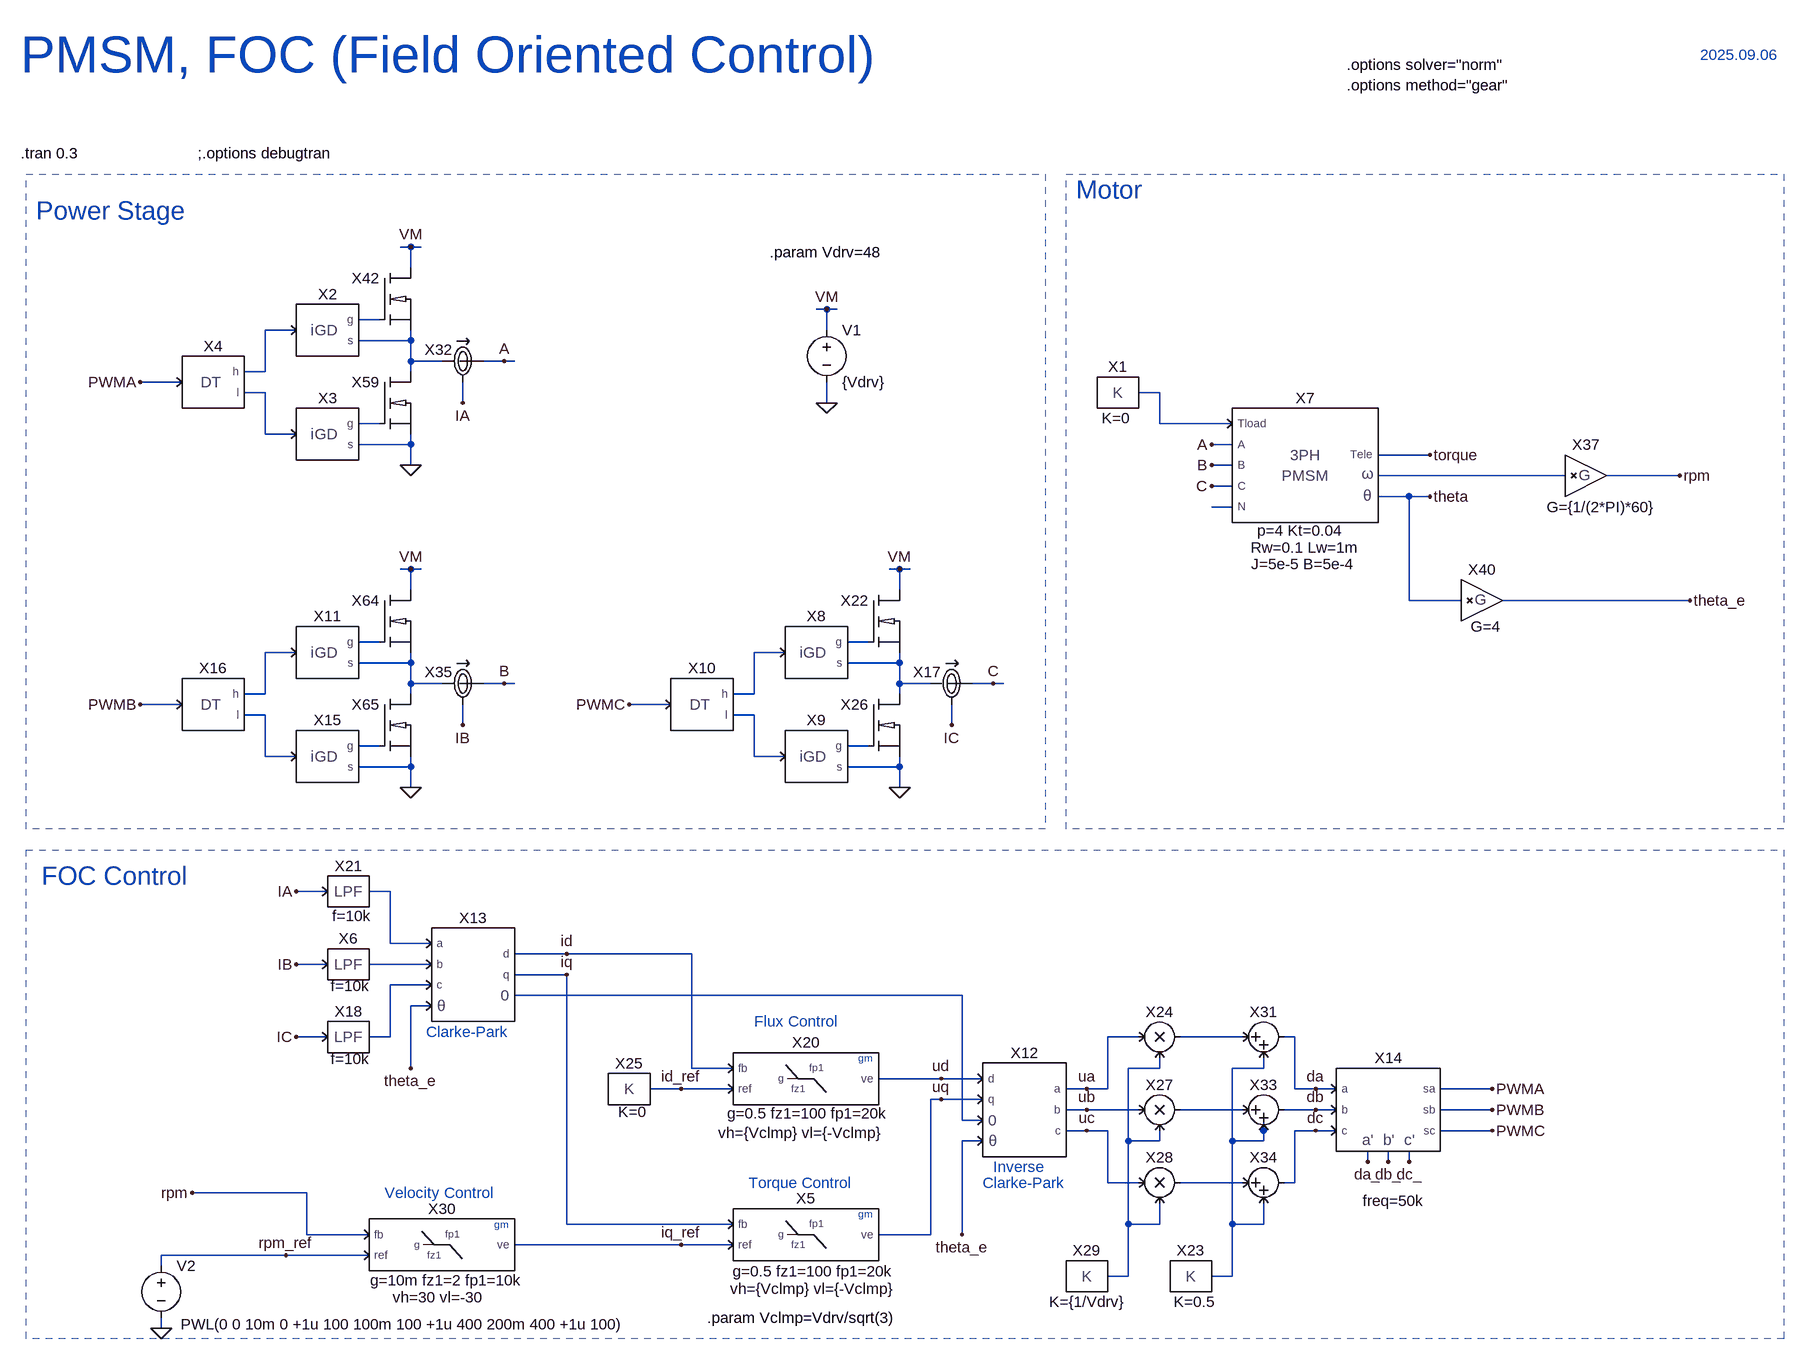
[diagram p0: schematic PMSM_FOC.asc]
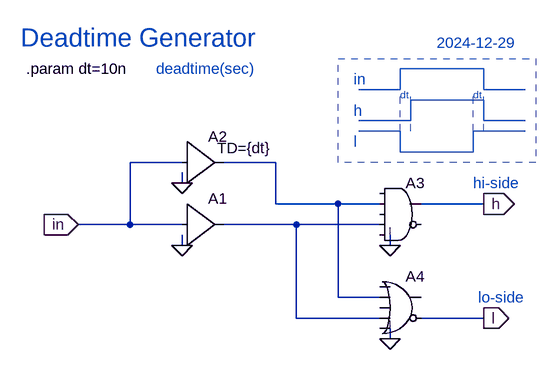
[diagram p1: sub-circuit deadtime.asc]
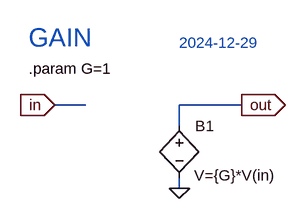
[diagram p2: sub-circuit gain.asc]
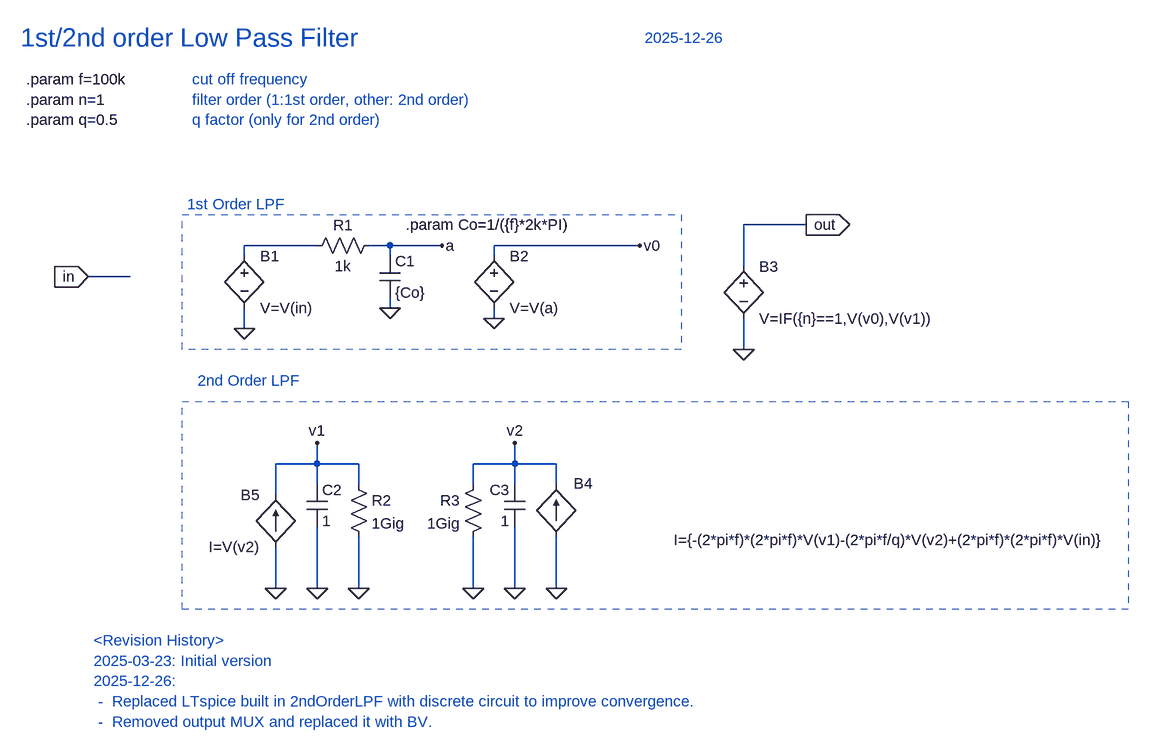
[diagram p3: sub-circuit lpf.asc]
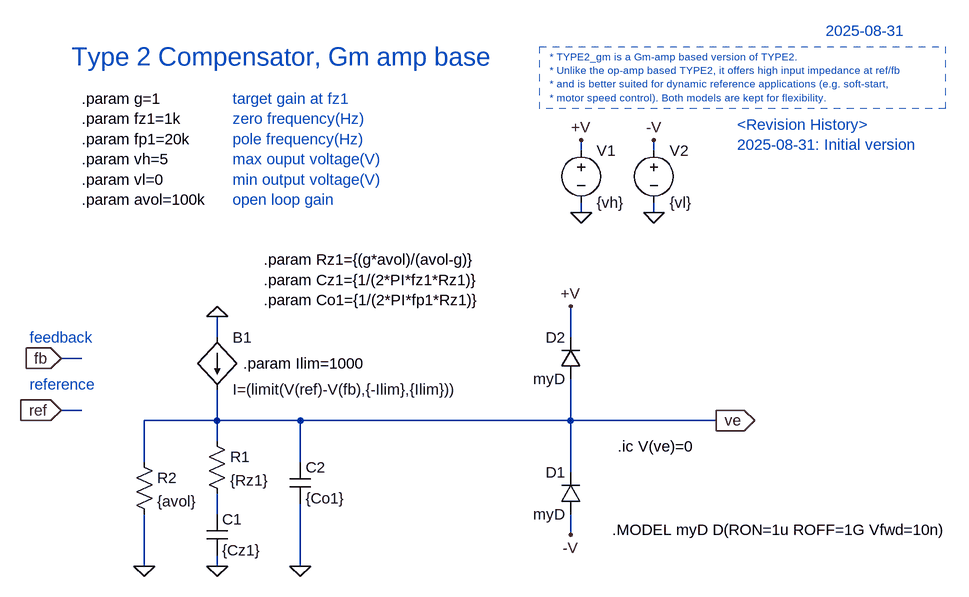
[diagram p4: sub-circuit type2_gm.asc]
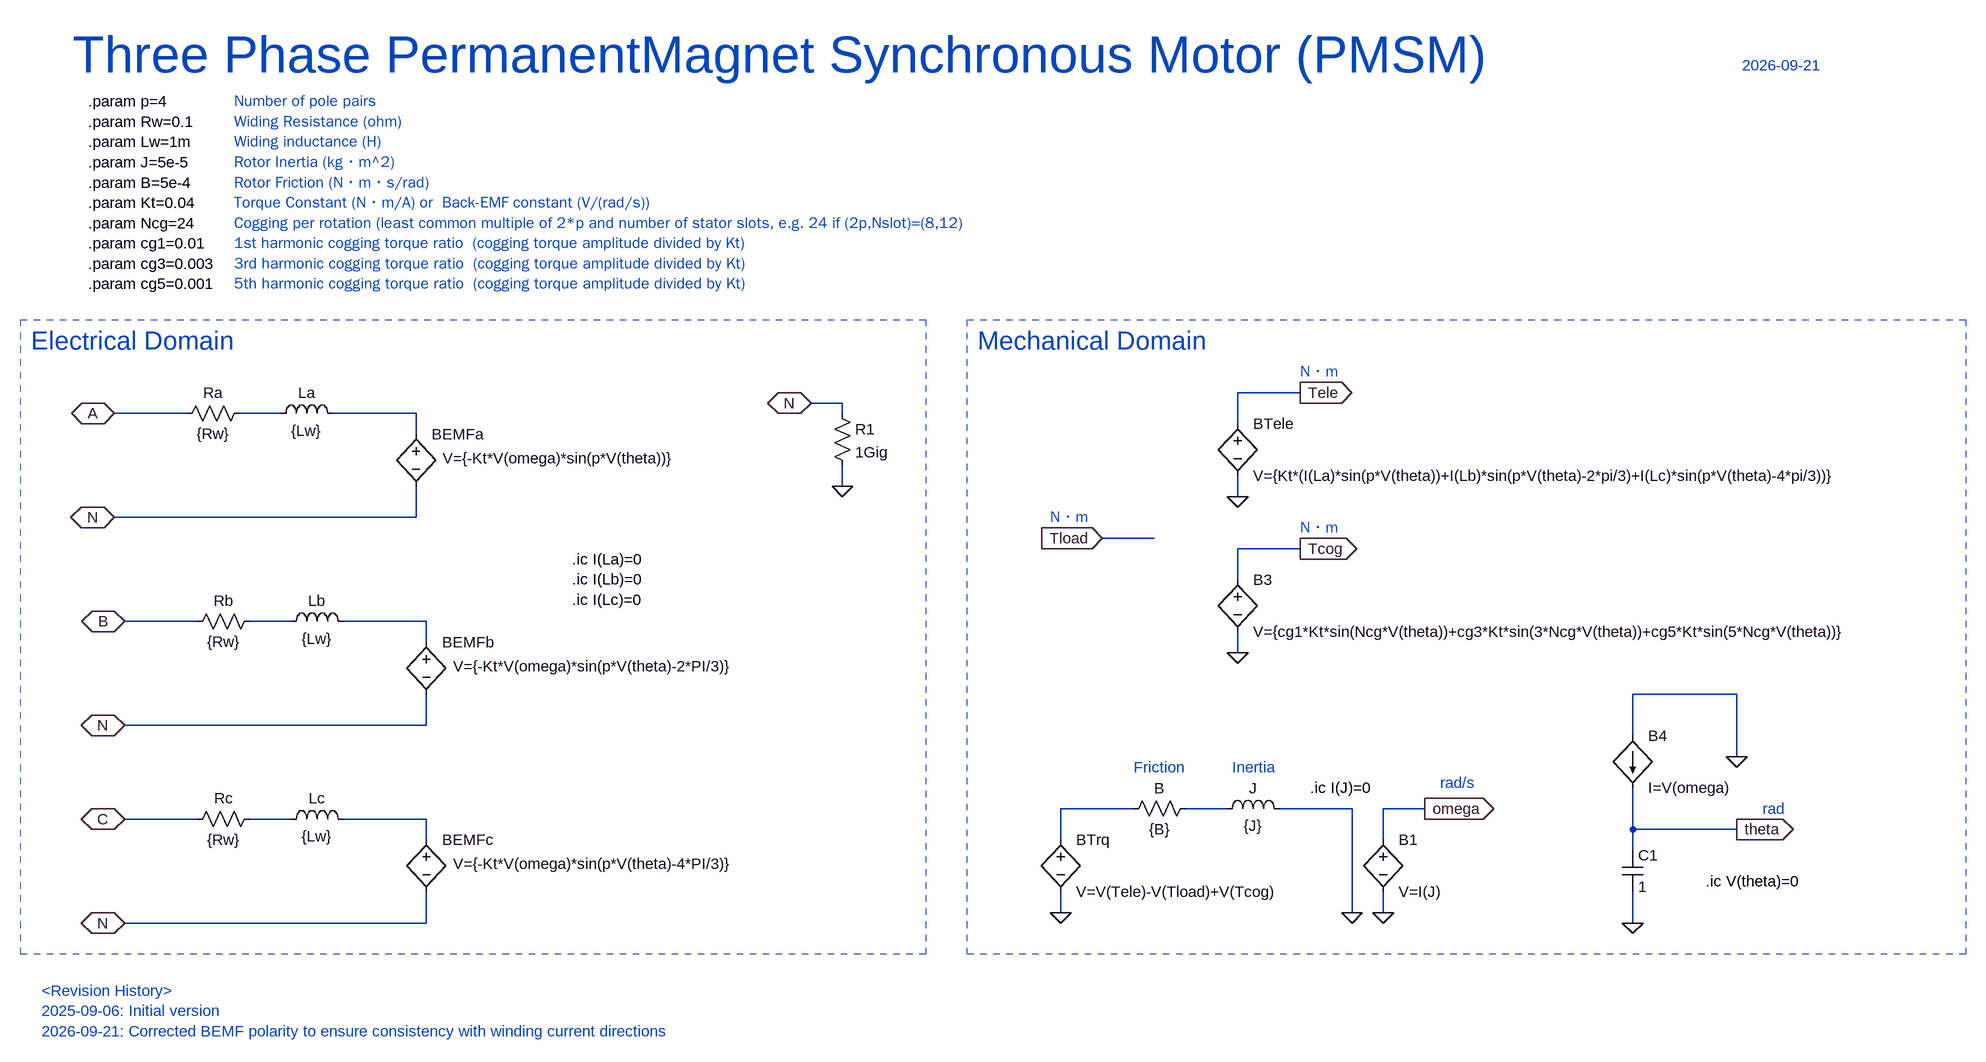
[diagram p5: sub-circuit pmsm.asc]
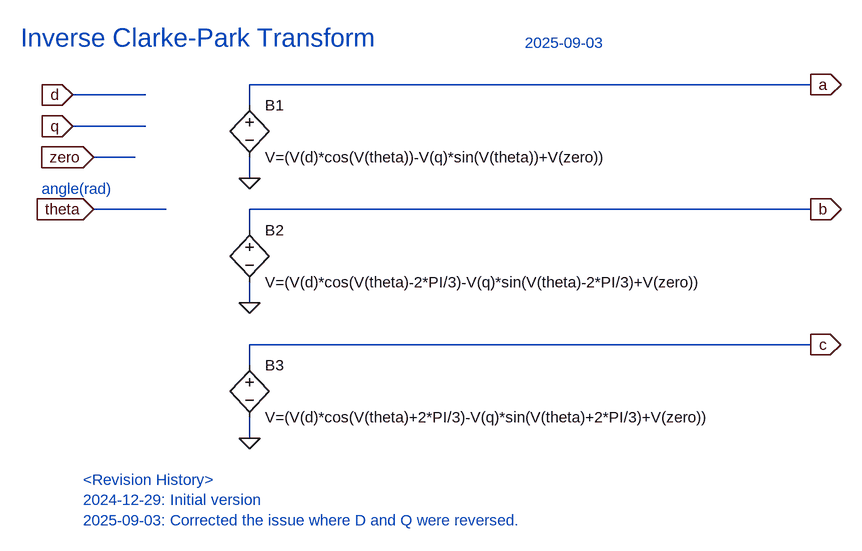
[diagram p6: sub-circuit clarke_parkinv.asc]
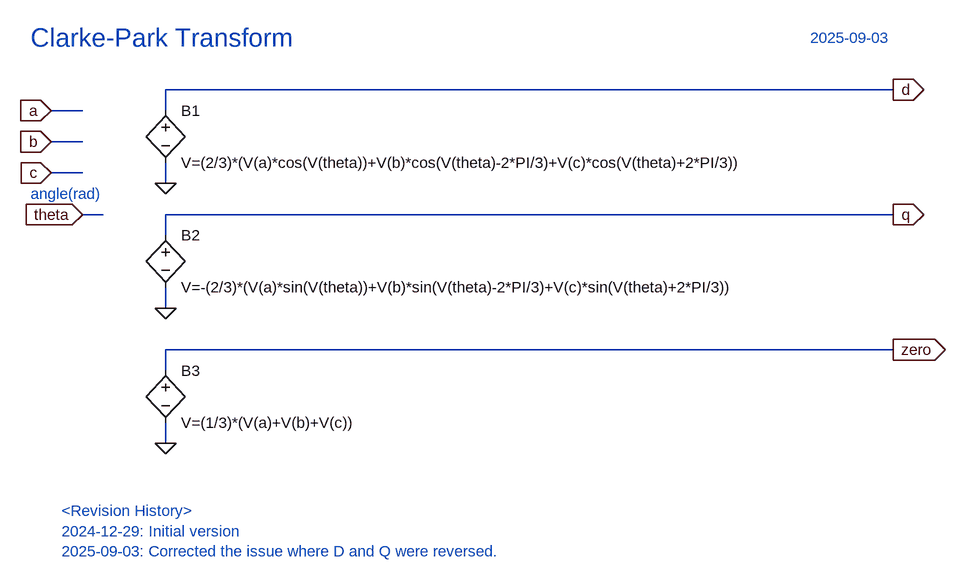
[diagram p7: sub-circuit clarke_park.asc]
PMSM_FOC.asc, the LTspice schematic file:
Version 4.1
SHEET 1 5496 2604
WIRE 3088 -96 3072 -96
WIRE 3104 -96 3088 -96
WIRE 3088 -64 3088 -96
WIRE 3728 0 3712 0
WIRE 3744 0 3728 0
WIRE 3040 16 3008 16
WIRE 2912 32 2864 32
WIRE 3728 32 3728 0
WIRE 3088 48 3088 32
WIRE 3088 48 3008 48
WIRE 3088 80 3088 48
WIRE 3136 80 3088 80
WIRE 3232 80 3200 80
WIRE 3248 80 3232 80
WIRE 2864 96 2864 32
WIRE 2864 96 2832 96
WIRE 3088 96 3088 80
WIRE 2736 112 2672 112
WIRE 2864 128 2832 128
WIRE 4240 128 4208 128
WIRE 3168 144 3168 112
WIRE 3728 144 3728 112
WIRE 3040 176 3008 176
WIRE 4240 176 4240 128
WIRE 4352 176 4240 176
WIRE 2864 192 2864 128
WIRE 2912 192 2864 192
WIRE 3088 208 3088 192
WIRE 3088 208 3008 208
WIRE 4352 208 4320 208
WIRE 4656 224 4576 224
WIRE 3088 240 3088 208
WIRE 4352 240 4320 240
WIRE 4864 256 4576 256
WIRE 5040 256 4928 256
WIRE 4352 272 4320 272
WIRE 4624 288 4576 288
WIRE 4656 288 4624 288
WIRE 4352 304 4320 304
WIRE 3088 400 3072 400
WIRE 3104 400 3088 400
WIRE 3840 400 3824 400
WIRE 3856 400 3840 400
WIRE 3088 432 3088 400
WIRE 3840 432 3840 400
WIRE 4624 448 4624 288
WIRE 4704 448 4624 448
WIRE 5056 448 4768 448
WIRE 3040 512 3008 512
WIRE 3792 512 3760 512
WIRE 2912 528 2864 528
WIRE 3664 528 3616 528
WIRE 3088 544 3088 528
WIRE 3088 544 3008 544
WIRE 3840 544 3840 528
WIRE 3840 544 3760 544
WIRE 3088 576 3088 544
WIRE 3136 576 3088 576
WIRE 3232 576 3200 576
WIRE 3248 576 3232 576
WIRE 3840 576 3840 544
WIRE 3888 576 3840 576
WIRE 3984 576 3952 576
WIRE 4000 576 3984 576
WIRE 2864 592 2864 528
WIRE 2864 592 2832 592
WIRE 3088 592 3088 576
WIRE 3616 592 3616 528
WIRE 3616 592 3584 592
WIRE 3840 592 3840 576
WIRE 2736 608 2672 608
WIRE 3488 608 3424 608
WIRE 2864 624 2832 624
WIRE 3616 624 3584 624
WIRE 3168 640 3168 608
WIRE 3920 640 3920 608
WIRE 3040 672 3008 672
WIRE 3792 672 3760 672
WIRE 2864 688 2864 624
WIRE 2912 688 2864 688
WIRE 3616 688 3616 624
WIRE 3664 688 3616 688
WIRE 3088 704 3088 688
WIRE 3088 704 3008 704
WIRE 3840 704 3840 688
WIRE 3840 704 3760 704
WIRE 3088 736 3088 704
WIRE 3840 736 3840 704
WIRE 2960 896 2912 896
WIRE 3056 896 3024 896
WIRE 3056 976 3056 896
WIRE 3120 976 3056 976
WIRE 3328 992 3248 992
WIRE 3520 992 3328 992
WIRE 2960 1008 2912 1008
WIRE 3120 1008 3024 1008
WIRE 3328 1024 3248 1024
WIRE 3120 1040 3056 1040
WIRE 3936 1056 3248 1056
WIRE 3120 1072 3088 1072
WIRE 2960 1120 2912 1120
WIRE 3056 1120 3056 1040
WIRE 3056 1120 3024 1120
WIRE 4208 1120 4160 1120
WIRE 4368 1120 4272 1120
WIRE 4448 1120 4432 1120
WIRE 3088 1168 3088 1072
WIRE 3520 1168 3520 992
WIRE 3584 1168 3520 1168
WIRE 4240 1168 4240 1152
WIRE 4240 1168 4192 1168
WIRE 4400 1168 4400 1152
WIRE 4400 1168 4352 1168
WIRE 3904 1184 3808 1184
WIRE 3968 1184 3904 1184
WIRE 3504 1200 3456 1200
WIRE 3584 1200 3504 1200
WIRE 4128 1200 4096 1200
WIRE 4160 1200 4160 1120
WIRE 4160 1200 4128 1200
WIRE 4448 1200 4448 1120
WIRE 4480 1200 4448 1200
WIRE 4512 1200 4480 1200
WIRE 4752 1200 4672 1200
WIRE 3904 1216 3888 1216
WIRE 3968 1216 3904 1216
WIRE 4128 1232 4096 1232
WIRE 4208 1232 4128 1232
WIRE 4368 1232 4272 1232
WIRE 4480 1232 4432 1232
WIRE 4512 1232 4480 1232
WIRE 4752 1232 4672 1232
WIRE 3936 1248 3936 1056
WIRE 3968 1248 3936 1248
WIRE 4128 1264 4096 1264
WIRE 4160 1264 4128 1264
WIRE 4400 1264 4400 1248
WIRE 4480 1264 4448 1264
WIRE 4512 1264 4480 1264
WIRE 4752 1264 4672 1264
WIRE 3968 1280 3936 1280
WIRE 4192 1280 4192 1168
WIRE 4240 1280 4240 1264
WIRE 4240 1280 4192 1280
WIRE 4352 1280 4352 1168
WIRE 4400 1280 4400 1264
WIRE 4400 1280 4352 1280
WIRE 4560 1312 4560 1296
WIRE 4592 1312 4592 1296
WIRE 4624 1312 4624 1296
WIRE 4160 1344 4160 1264
WIRE 4208 1344 4160 1344
WIRE 4368 1344 4272 1344
WIRE 4448 1344 4448 1264
WIRE 4448 1344 4432 1344
WIRE 2928 1360 2752 1360
WIRE 3328 1408 3328 1024
WIRE 3584 1408 3328 1408
WIRE 4192 1408 4192 1280
WIRE 4240 1408 4240 1376
WIRE 4240 1408 4192 1408
WIRE 4352 1408 4352 1280
WIRE 4400 1408 4400 1376
WIRE 4400 1408 4352 1408
WIRE 2928 1424 2928 1360
WIRE 3024 1424 2928 1424
WIRE 3888 1424 3888 1216
WIRE 3888 1424 3808 1424
WIRE 3936 1424 3936 1280
WIRE 3504 1440 3248 1440
WIRE 3584 1440 3504 1440
WIRE 2896 1456 2704 1456
WIRE 3024 1456 2896 1456
WIRE 2704 1472 2704 1456
WIRE 4192 1488 4192 1408
WIRE 4192 1488 4160 1488
WIRE 4352 1488 4352 1408
WIRE 4352 1488 4320 1488
WIRE 2704 1568 2704 1552
FLAG 3504 1200 id_ref
FLAG 3328 992 id
FLAG 3328 1024 iq
FLAG 3088 1168 theta_e
FLAG 3936 1424 theta_e
FLAG 4656 288 theta
FLAG 3088 240 0
FLAG 3232 80 A
FLAG 4320 240 B
FLAG 3088 -96 VM
FLAG 2672 112 PWMA
FLAG 4656 224 torque
FLAG 3088 736 0
FLAG 3232 576 B
FLAG 3088 400 VM
FLAG 2672 608 PWMB
FLAG 3728 144 0
FLAG 3728 0 VM
FLAG 3168 144 IA
FLAG 3168 640 IB
FLAG 4320 208 A
FLAG 4320 272 C
FLAG 5040 256 rpm
FLAG 2912 896 IA
FLAG 2912 1008 IB
FLAG 3904 1184 ud
FLAG 3904 1216 uq
FLAG 2896 1456 rpm_ref
FLAG 2752 1360 rpm
FLAG 3504 1440 iq_ref
FLAG 3840 736 0
FLAG 3984 576 C
FLAG 3840 400 VM
FLAG 3424 608 PWMC
FLAG 3920 640 IC
FLAG 4752 1200 PWMA
FLAG 4752 1232 PWMB
FLAG 4752 1264 PWMC
FLAG 2912 1120 IC
FLAG 4128 1200 ua
FLAG 4128 1232 ub
FLAG 4128 1264 uc
FLAG 4480 1200 da
FLAG 4480 1232 db
FLAG 4480 1264 dc
FLAG 5056 448 theta_e
FLAG 4560 1312 da_
FLAG 4592 1312 db_
FLAG 4624 1312 dc_
FLAG 2704 1568 0
SYMBOL CONST 4176 128 R0
WINDOW 39 -3 55 Bottom 2
SYMATTR SpiceLine K=0
SYMATTR InstName X1
SYMBOL iGD 2960 32 R0
SYMATTR InstName X2
SYMBOL iGD 2960 192 R0
SYMATTR InstName X3
SYMBOL DEADTIME 2784 112 R0
SYMATTR InstName X4
SYMBOL iGD 2960 528 R0
SYMATTR InstName X11
SYMBOL iGD 2960 688 R0
SYMATTR InstName X15
SYMBOL DEADTIME 2784 608 R0
SYMATTR InstName X16
SYMBOL voltage 3728 16 R0
SYMATTR InstName V1
SYMATTR Value {Vdrv}
SYMBOL IMON 3168 80 R0
SYMATTR InstName X32
SYMBOL IMON 3168 576 R0
SYMATTR InstName X35
SYMBOL GAIN 4896 256 R0
WINDOW 39 23 64 Bottom 2
SYMATTR SpiceLine G={1/(2*PI)*60}
SYMATTR InstName X37
SYMBOL iNMOS 3088 -16 R0
SYMATTR InstName X42
SYMBOL iNMOS 3088 144 R0
SYMATTR InstName X59
SYMBOL iNMOS 3088 480 R0
SYMATTR InstName X64
SYMBOL iNMOS 3088 640 R0
SYMATTR InstName X65
SYMBOL LPF 2992 896 R0
WINDOW 3 5 53 Bottom 2
SYMATTR Value f=10k
SYMATTR InstName X21
SYMBOL TYPE2_gm 3136 1440 R0
WINDOW 39 7 70 Bottom 2
WINDOW 40 -6 96 Bottom 2
SYMATTR SpiceLine g=10m fz1=2 fp1=10k
SYMATTR SpiceLine2 vh=30 vl=-30
SYMATTR InstName X30
SYMBOL TYPE2_gm 3696 1184 R0
WINDOW 39 3 69 Bottom 2
WINDOW 40 -9 99 Bottom 2
SYMATTR SpiceLine g=0.5 fz1=100 fp1=20k
SYMATTR SpiceLine2 vh={Vclmp} vl={-Vclmp}
SYMATTR InstName X20
SYMBOL TYPE2_gm 3696 1424 R0
WINDOW 39 12 72 Bottom 2
WINDOW 40 10 99 Bottom 2
SYMATTR SpiceLine g=0.5 fz1=100 fp1=20k
SYMATTR SpiceLine2 vh={Vclmp} vl={-Vclmp}
SYMATTR InstName X5
SYMBOL LPF 2992 1008 R0
WINDOW 3 3 49 Bottom 2
SYMATTR Value f=10k
SYMATTR InstName X6
SYMBOL PMSM 4464 240 R0
WINDOW 3 -8 116 Bottom 2
WINDOW 123 0 142 Bottom 2
WINDOW 39 -3 168 Bottom 2
SYMATTR InstName X7
SYMBOL iGD 3712 528 R0
SYMATTR InstName X8
SYMBOL iGD 3712 688 R0
SYMATTR InstName X9
SYMBOL DEADTIME 3536 608 R0
SYMATTR InstName X10
SYMBOL IMON 3920 576 R0
SYMATTR InstName X17
SYMBOL iNMOS 3840 480 R0
SYMATTR InstName X22
SYMBOL iNMOS 3840 640 R0
SYMATTR InstName X26
SYMBOL CLARKE_PARKinv 4032 1232 R0
SYMATTR InstName X12
SYMBOL CLARKE_PARK 3184 1024 R0
SYMATTR InstName X13
SYMBOL SV_PWM 4592 1232 R0
WINDOW 39 8 156 Bottom 2
SYMATTR SpiceLine freq=50k
SYMATTR InstName X14
SYMBOL LPF 2992 1120 R0
WINDOW 3 3 49 Bottom 2
SYMATTR Value f=10k
SYMATTR InstName X18
SYMBOL MUL 4240 1120 R0
SYMATTR InstName X24
SYMBOL MUL 4240 1232 R0
SYMATTR InstName X27
SYMBOL MUL 4240 1344 R0
SYMATTR InstName X28
SYMBOL CONST 4128 1488 R0
WINDOW 39 0 55 Bottom 2
SYMATTR SpiceLine K={1/Vdrv}
SYMATTR InstName X29
SYMBOL SUM 4400 1120 R0
SYMATTR InstName X31
SYMBOL SUM 4400 1232 R0
SYMATTR InstName X33
SYMBOL SUM 4400 1344 R0
SYMATTR InstName X34
SYMBOL CONST 4288 1488 R0
WINDOW 39 6 55 Bottom 2
SYMATTR SpiceLine K=0.5
SYMATTR InstName X23
SYMBOL GAIN 4736 448 R0
WINDOW 39 6 56 Bottom 2
SYMATTR SpiceLine G=4
SYMATTR InstName X40
SYMBOL CONST 3424 1200 R0
WINDOW 39 5 51 Bottom 2
SYMATTR SpiceLine K=0
SYMATTR InstName X25
SYMBOL voltage 2704 1456 R0
WINDOW 123 0 0 Left 0
WINDOW 39 0 0 Left 0
WINDOW 3 30 106 Left 2
SYMATTR Value PWL(0 0 10m 0 +1u 100 100m 100 +1u 400 200m 400 +1u 100)
SYMATTR InstName V2
TEXT 2488 -240 Left 2 !.tran 0.3
TEXT 4528 -376 Left 2 !.options solver="norm"\n.options method="gear"
TEXT 2488 -392 Left 6 ;PMSM, FOC (Field Oriented Control)
TEXT 4112 -184 Left 4 ;Motor
TEXT 5072 -392 Left 2 ;2025.09.06
TEXT 2512 -152 Left 4 ;Power Stage
TEXT 3608 1344 Left 2 ;Torque Control
TEXT 3616 1096 Left 2 ;Flux Control
TEXT 2760 -240 Left 2 !;.options debugtran
TEXT 3048 1360 Left 2 ;Velocity Control
TEXT 3640 -88 Left 2 !.param Vdrv=48
TEXT 2520 872 Left 4 ;FOC Control
TEXT 3776 1152 Left 1 ;gm
TEXT 3776 1392 Left 1 ;gm
TEXT 3216 1408 Left 1 ;gm
TEXT 3112 1112 Left 2 ;Clarke-Park
TEXT 3968 1344 Left 2 ;Clarke-Park
TEXT 3984 1320 Left 2 ;Inverse
TEXT 3544 1552 Left 2 !.param Vclmp=Vdrv/sqrt(3)
RECTANGLE Normal 4064 800 2496 -208 2
RECTANGLE Normal 5200 800 4096 -208 2
RECTANGLE Normal 5200 1584 2496 832 2

deadtime.asc, the sub-circuit schematic file:
Version 4
SHEET 1 1412 1312
WIRE 64 288 -16 288
WIRE 208 288 128 288
WIRE 64 320 64 304
WIRE 208 352 208 288
WIRE 304 352 208 352
WIRE 368 352 304 352
WIRE 528 352 432 352
WIRE -16 384 -16 288
WIRE -16 384 -96 384
WIRE 64 384 -16 384
WIRE 240 384 128 384
WIRE 368 384 240 384
WIRE 64 416 64 400
WIRE 384 416 384 400
WIRE 304 496 304 352
WIRE 368 496 304 496
WIRE 240 528 240 384
WIRE 368 528 240 528
WIRE 528 528 432 528
WIRE 384 560 384 544
FLAG -96 384 in
IOPIN -96 384 In
FLAG 64 416 0
FLAG 64 320 0
FLAG 384 416 0
FLAG 384 560 0
FLAG 528 352 h
IOPIN 528 352 Out
FLAG 528 528 l
IOPIN 528 528 Out
SYMBOL Digital\\buf1 64 320 R0
SYMATTR InstName A1
SYMBOL Digital\\buf1 64 224 R0
WINDOW 3 54 42 Left 2
SYMATTR Value TD={dt}
SYMATTR InstName A2
SYMBOL Digital\\and 400 304 R0
SYMATTR InstName A3
SYMBOL Digital\\or 400 448 R0
SYMATTR InstName A4
TEXT -176 144 Left 2 !.param dt=10n
TEXT -184 96 Left 4 ;Deadtime Generator
TEXT 24 144 Left 2 ;deadtime(sec)
TEXT 512 320 Left 2 ;hi-side
TEXT 520 496 Left 2 ;lo-side
TEXT 328 160 Left 2 ;in
TEXT 328 208 Left 2 ;h
TEXT 328 256 Left 2 ;l
TEXT 400 184 Left 1 ;dt
TEXT 512 184 Left 1 ;dt
TEXT 456 104 Left 2 ;2024-12-29
LINE Normal 400 176 336 176
LINE Normal 400 176 400 144
LINE Normal 528 144 400 144
LINE Normal 528 176 528 144
LINE Normal 592 176 528 176
LINE Normal 416 224 336 224
LINE Normal 416 224 416 192
LINE Normal 528 192 416 192
LINE Normal 528 224 528 192
LINE Normal 592 224 528 224
LINE Normal 400 240 336 240
LINE Normal 400 272 400 240
LINE Normal 512 272 400 272
LINE Normal 512 272 512 240
LINE Normal 592 240 512 240
LINE Normal 400 240 400 176 2
LINE Normal 512 240 512 176 2
LINE Normal 416 240 416 176 2
LINE Normal 528 240 528 176 2
RECTANGLE Normal 608 288 304 128 2

gain.asc, the sub-circuit schematic file:
Version 4
SHEET 1 880 680
WIRE 0 64 -48 64
WIRE 240 64 144 64
WIRE 144 96 144 64
WIRE 144 192 144 176
FLAG 144 192 0
FLAG 240 64 out
IOPIN 240 64 Out
FLAG -48 64 in
IOPIN -48 64 In
SYMBOL bv 144 80 R0
WINDOW 3 23 92 Left 2
SYMATTR Value V={G}*V(in)
SYMATTR InstName B1
TEXT -88 8 Left 2 !.param G=1
TEXT -88 -40 Left 4 ;GAIN
TEXT 144 -32 Left 2 ;2024-12-29

lpf.asc, the sub-circuit schematic file:
Version 4.1
SHEET 1 1652 804
WIRE 944 -80 848 -80
WIRE 192 -48 80 -48
WIRE 304 -48 272 -48
WIRE 384 -48 304 -48
WIRE 688 -48 464 -48
WIRE 80 -32 80 -48
WIRE 304 -32 304 -48
WIRE 464 -32 464 -48
WIRE 848 -16 848 -80
WIRE -96 0 -160 0
WIRE 304 48 304 32
WIRE 464 64 464 48
WIRE 80 80 80 48
WIRE 848 112 848 64
WIRE 192 288 192 256
WIRE 192 288 128 288
WIRE 256 288 192 288
WIRE 496 288 496 256
WIRE 496 288 432 288
WIRE 560 288 496 288
WIRE 192 320 192 288
WIRE 256 320 256 288
WIRE 432 320 432 288
WIRE 496 320 496 288
WIRE 560 320 560 288
WIRE 128 336 128 288
WIRE 128 480 128 416
WIRE 192 480 192 384
WIRE 256 480 256 400
WIRE 432 480 432 400
WIRE 496 480 496 384
WIRE 560 480 560 400
FLAG -160 0 in
IOPIN -160 0 In
FLAG 944 -80 out
IOPIN 944 -80 Out
FLAG 304 48 0
FLAG 80 80 0
FLAG 384 -48 a
FLAG 464 64 0
FLAG 848 112 0
FLAG 256 480 0
FLAG 192 256 v1
FLAG 496 256 v2
FLAG 128 480 0
FLAG 560 480 0
FLAG 688 -48 v0
FLAG 192 480 0
FLAG 496 480 0
FLAG 432 480 0
SYMBOL res 288 -64 R90
WINDOW 0 0 56 VBottom 2
WINDOW 3 32 56 VTop 2
SYMATTR InstName R1
SYMATTR Value 1k
SYMBOL cap 288 -32 R0
SYMATTR InstName C1
SYMATTR Value {Co}
SYMBOL bv 80 -48 R0
SYMATTR InstName B1
SYMATTR Value V=V(in)
SYMBOL bv 464 -48 R0
SYMATTR InstName B2
SYMATTR Value V=V(a)
SYMBOL bv 848 -32 R0
SYMATTR InstName B3
SYMATTR Value V=IF({n}==1,V(v0),V(v1))
SYMBOL res 240 304 R0
SYMATTR InstName R2
SYMATTR Value 1Gig
SYMBOL cap 176 320 R0
SYMATTR InstName C2
SYMATTR Value 1
SYMBOL bi 128 416 R180
WINDOW 0 24 80 Left 2
WINDOW 3 24 0 Left 2
SYMATTR InstName B5
SYMATTR Value I=V(v2)
SYMBOL res 448 304 M0
SYMATTR InstName R3
SYMATTR Value 1Gig
SYMBOL cap 512 320 M0
SYMATTR InstName C3
SYMATTR Value 1
SYMBOL bi 560 400 R180
WINDOW 3 -848 -5 Left 2
WINDOW 0 -56 82 Left 2
SYMATTR Value I={-(2*pi*f)*(2*pi*f)*V(v1)-(2*pi*f/q)*V(v2)+(2*pi*f)*(2*pi*f)*V(in)}
SYMATTR InstName B4
TEXT -264 -368 Left 4 ;1st/2nd order Low Pass Filter
TEXT 696 -368 Left 2 ;2025-12-26
TEXT -256 -304 Left 2 !.param f=100k\n.param n=1\n.param q=0.5
TEXT 328 -80 Left 2 !.param Co=1/({f}*2k*PI)
TEXT 0 -304 Left 2 ;cut off frequency\nfilter order (1:1st order, other: 2nd order)\nq factor (only for 2nd order)
TEXT -8 -112 Left 2 ;1st Order LPF
TEXT 8 160 Left 2 ;2nd Order LPF
TEXT -152 560 Left 2 ;<Revision History>\n2025-03-23: Initial version\n2025-12-26: \n -  Replaced LTspice built in 2ndOrderLPF with discrete circuit to improve convergence.\n -  Removed output MUX and replaced it with BV.
RECTANGLE Normal 752 112 -16 -96 2
RECTANGLE Normal 1440 512 -16 192 2

type2_gm.asc, the sub-circuit schematic file:
Version 4.1
SHEET 1 1136 680
WIRE 432 -144 432 -160
WIRE 544 -144 544 -160
WIRE 432 -48 432 -64
WIRE 544 -48 544 -64
WIRE -128 144 -128 112
WIRE 416 144 416 96
WIRE -336 176 -368 176
WIRE -336 256 -368 256
WIRE -128 272 -128 224
WIRE -128 272 -240 272
WIRE 0 272 -128 272
WIRE 416 272 416 208
WIRE 416 272 0 272
WIRE 640 272 416 272
WIRE -128 304 -128 272
WIRE -240 336 -240 272
WIRE 0 336 0 272
WIRE 416 352 416 272
WIRE -128 416 -128 384
WIRE 416 448 416 416
WIRE -240 496 -240 416
WIRE -128 496 -128 480
WIRE 0 496 0 400
FLAG 640 272 ve
IOPIN 640 272 Out
FLAG -128 496 0
FLAG -240 496 0
FLAG 0 496 0
FLAG -128 112 0
FLAG 544 -48 0
FLAG 432 -48 0
FLAG 432 -160 +V
FLAG 544 -160 -V
FLAG 416 448 -V
FLAG 416 96 +V
FLAG -368 176 fb
IOPIN -368 176 In
FLAG -368 256 ref
IOPIN -368 256 In
SYMBOL bi -128 144 R0
SYMATTR InstName B1
SYMATTR Value I=(limit(V(ref)-V(fb),{-Ilim},{Ilim}))
SYMBOL res -144 288 R0
SYMATTR InstName R1
SYMATTR Value {Rz1}
SYMBOL cap -144 416 R0
SYMATTR InstName C1
SYMATTR Value {Cz1}
SYMBOL res -256 320 R0
SYMATTR InstName R2
SYMATTR Value {avol}
SYMBOL cap -16 336 R0
SYMATTR InstName C2
SYMATTR Value {Co1}
SYMBOL diode 432 416 R180
WINDOW 0 24 64 Left 2
WINDOW 3 24 0 Left 2
SYMATTR InstName D1
SYMATTR Value myD
SYMBOL voltage 432 -160 R0
SYMATTR InstName V1
SYMATTR Value {vh}
SYMBOL voltage 544 -160 R0
WINDOW 123 0 0 Left 0
WINDOW 39 24 44 Left 2
SYMATTR InstName V2
SYMATTR Value {vl}
SYMBOL diode 432 208 R180
WINDOW 0 24 64 Left 2
WINDOW 3 24 0 Left 2
SYMATTR InstName D2
SYMATTR Value myD
TEXT -336 -224 Left 2 !.param g=1\n.param fz1=1k\n.param fp1=20k\n.param vh=5\n.param vl=0\n.param avol=100k
TEXT -352 -288 Left 4 ;Type 2 Compensator, Gm amp base
TEXT -104 -224 Left 2 ;target gain at fz1\nzero frequency(Hz)\npole frequency(Hz)\nmax ouput voltage(V)\nmin output voltage(V)\nopen loop gain
TEXT 808 -328 Left 2 ;2025-08-31
TEXT -56 24 Left 2 !.param Rz1={(g*avol)/(avol-g)}\n.param Cz1={1/(2*PI*fz1*Rz1)}\n.param Co1={1/(2*PI*fp1*Rz1)}
TEXT 488 312 Left 2 !.ic V(ve)=0
TEXT 480 440 Left 2 !.MODEL myD D(RON=1u ROFF=1G Vfwd=10n)
TEXT -88 184 Left 2 !.param Ilim=1000
TEXT 672 -184 Left 2 ;<Revision History>\n2025-08-31: Initial version
TEXT -416 144 Left 2 ;feedback
TEXT -416 216 Left 2 ;reference
TEXT 384 -288 Left 1 ;* TYPE2_gm is a Gm-amp based version of TYPE2.\n* Unlike the op-amp based TYPE2, it offers high input impedance at ref/fb\n* and is better suited for dynamic reference applications (e.g. soft-start,\n* motor speed control). Both models are kept for flexibility.
RECTANGLE Normal 992 -208 368 -304 2

pmsm.asc, the sub-circuit schematic file:
Version 4.1
SHEET 1 2928 2296
WIRE 1760 560 1664 560
WIRE 1056 576 1008 576
WIRE 48 592 -64 592
WIRE 192 592 128 592
WIRE 400 592 272 592
WIRE 1056 592 1056 576
WIRE 1664 608 1664 560
WIRE 400 624 400 592
WIRE 1056 704 1056 672
WIRE 1664 720 1664 688
WIRE 400 752 400 704
WIRE 400 752 -64 752
WIRE 1536 784 1456 784
WIRE 1760 800 1664 800
WIRE 1664 848 1664 800
WIRE 64 912 -48 912
WIRE 208 912 144 912
WIRE 416 912 288 912
WIRE 416 944 416 912
WIRE 1664 960 1664 928
WIRE 2432 1024 2272 1024
WIRE 416 1072 416 1024
WIRE 416 1072 -48 1072
WIRE 2272 1088 2272 1024
WIRE 2432 1120 2432 1024
WIRE 1504 1200 1392 1200
WIRE 1648 1200 1584 1200
WIRE 1840 1200 1728 1200
WIRE 1952 1200 1888 1200
WIRE 64 1216 -48 1216
WIRE 208 1216 144 1216
WIRE 416 1216 288 1216
WIRE 2272 1232 2272 1168
WIRE 2432 1232 2272 1232
WIRE 416 1248 416 1216
WIRE 1392 1248 1392 1200
WIRE 1888 1248 1888 1200
WIRE 2272 1264 2272 1232
WIRE 1392 1360 1392 1328
WIRE 1840 1360 1840 1200
WIRE 1888 1360 1888 1328
WIRE 416 1376 416 1328
WIRE 416 1376 -48 1376
WIRE 2272 1376 2272 1328
FLAG 1664 960 0
FLAG 1392 1360 0
FLAG 2272 1376 0
FLAG 1456 784 Tload
IOPIN 1456 784 In
FLAG -64 592 A
IOPIN -64 592 BiDir
FLAG -48 912 B
IOPIN -48 912 BiDir
FLAG 2432 1232 theta
IOPIN 2432 1232 Out
FLAG 1952 1200 omega
IOPIN 1952 1200 Out
FLAG 1760 800 Tcog
IOPIN 1760 800 Out
FLAG 1840 1360 0
FLAG 2432 1120 0
FLAG 1664 720 0
FLAG 1760 560 Tele
IOPIN 1760 560 Out
FLAG -64 752 N
IOPIN -64 752 BiDir
FLAG -48 1072 N
IOPIN -48 1072 BiDir
FLAG -48 1216 C
IOPIN -48 1216 BiDir
FLAG -48 1376 N
IOPIN -48 1376 BiDir
FLAG 1008 576 N
IOPIN 1008 576 BiDir
FLAG 1056 704 0
FLAG 1888 1360 0
SYMBOL res 144 576 R90
WINDOW 0 0 56 VBottom 2
WINDOW 3 32 56 VTop 2
SYMATTR InstName Ra
SYMATTR Value {Rw}
SYMBOL ind 288 608 M270
WINDOW 0 32 56 VTop 2
WINDOW 3 5 56 VBottom 2
SYMATTR InstName La
SYMATTR Value {Lw}
SYMBOL res 160 896 R90
WINDOW 0 0 56 VBottom 2
WINDOW 3 32 56 VTop 2
SYMATTR InstName Rb
SYMATTR Value {Rw}
SYMBOL ind 304 928 M270
WINDOW 0 32 56 VTop 2
WINDOW 3 5 56 VBottom 2
SYMATTR InstName Lb
SYMATTR Value {Lw}
SYMBOL bv 416 928 R0
WINDOW 3 41 53 Left 2
SYMATTR Value V={-Kt*V(omega)*sin(p*V(theta)-2*PI/3)}
SYMATTR InstName BEMFb
SYMBOL bv 1664 832 R0
SYMATTR InstName B3
SYMATTR Value V={cg1*Kt*sin(Ncg*V(theta))+cg3*Kt*sin(3*Ncg*V(theta))+cg5*Kt*sin(5*Ncg*V(theta))}
SYMBOL ind 1632 1216 R270
WINDOW 0 32 56 VTop 2
WINDOW 3 5 56 VBottom 2
SYMATTR InstName J
SYMATTR Value {J}
SYMBOL bv 1392 1232 R0
SYMATTR InstName BTrq
SYMATTR Value V=V(Tele)-V(Tload)+V(Tcog)
SYMBOL cap 2256 1264 R0
SYMATTR InstName C1
SYMATTR Value 1
SYMBOL res 1600 1184 R90
WINDOW 0 0 56 VBottom 2
WINDOW 3 32 56 VTop 2
SYMATTR InstName B
SYMATTR Value {B}
SYMBOL bi 2272 1088 R0
SYMATTR InstName B4
SYMATTR Value I=V(omega)
SYMBOL bv 400 608 R0
WINDOW 3 41 53 Left 2
SYMATTR Value V={-Kt*V(omega)*sin(p*V(theta))}
SYMATTR InstName BEMFa
SYMBOL bv 1664 592 R0
SYMATTR InstName BTele
SYMATTR Value V={Kt*(I(La)*sin(p*V(theta))+I(Lb)*sin(p*V(theta)-2*pi/3)+I(Lc)*sin(p*V(theta)-4*pi/3))}
SYMBOL res 160 1200 R90
WINDOW 0 0 56 VBottom 2
WINDOW 3 32 56 VTop 2
SYMATTR InstName Rc
SYMATTR Value {Rw}
SYMBOL ind 304 1232 M270
WINDOW 0 32 56 VTop 2
WINDOW 3 5 56 VBottom 2
SYMATTR InstName Lc
SYMATTR Value {Lw}
SYMBOL bv 416 1232 R0
WINDOW 3 41 53 Left 2
SYMATTR Value V={-Kt*V(omega)*sin(p*V(theta)-4*PI/3)}
SYMATTR InstName BEMFc
SYMBOL res 1040 576 R0
SYMATTR InstName R1
SYMATTR Value 1Gig
SYMBOL bv 1888 1232 R0
SYMATTR InstName B1
SYMATTR Value V=I(J)
TEXT -104 112 Left 2 !.param p=4\n.param Rw=0.1\n.param Lw=1m\n.param J=5e-5\n.param B=5e-4\n.param Kt=0.04\n.param Ncg=24\n.param cg1=0.01\n.param cg3=0.003\n.param cg5=0.001
TEXT -128 40 Left 6 ;Three Phase PermanentMagnet Synchronous Motor (PMSM)
TEXT 2440 56 Left 2 ;2026-09-21
TEXT 2384 1312 Left 2 !.ic V(theta)=0
TEXT 1776 1168 Left 2 !.ic I(J)=0
TEXT 1656 1136 Left 2 ;Inertia
TEXT 1504 1136 Left 2 ;Friction
TEXT 640 816 Left 2 !.ic I(La)=0\n.ic I(Lb)=0\n.ic I(Lc)=0
TEXT 120 112 Left 2 ;Number of pole pairs\nWiding Resistance (ohm)\nWiding inductance (H)\nRotor Inertia (kg・m^2)\nRotor Friction (N・m・s/rad)\nTorque Constant (N・m/A) or  Back-EMF constant (V/(rad/s))\nCogging per rotation (least common multiple of 2*p and number of stator slots, e.g. 24 if (2p,Nslot)=(8,12)\n1st harmonic cogging torque ratio  (cogging torque amplitude divided by Kt)\n3rd harmonic cogging torque ratio  (cogging torque amplitude divided by Kt)\n5th harmonic cogging torque ratio  (cogging torque amplitude divided by Kt)
TEXT -176 1480 Left 2 ;<Revision History>\n2025-09-06: Initial version\n2026-09-21: Corrected BEMF polarity to ensure consistency with winding current directions
TEXT -192 480 Left 4 ;Electrical Domain
TEXT 1264 480 Left 4 ;Mechanical Domain
TEXT 2472 1200 Left 2 ;rad
TEXT 1976 1160 Left 2 ;rad/s
TEXT 1376 752 Left 2 ;N・m
TEXT 1760 528 Left 2 ;N・m
TEXT 1760 768 Left 2 ;N・m
RECTANGLE Normal 1184 1424 -208 448 2
RECTANGLE Normal 2784 1424 1248 448 2

clarke_parkinv.asc, the sub-circuit schematic file:
Version 4.1
SHEET 1 1416 808
WIRE 1264 128 400 128
WIRE 240 144 128 144
WIRE 400 160 400 128
WIRE 240 192 128 192
WIRE 224 240 160 240
WIRE 400 272 400 240
WIRE 272 320 160 320
WIRE 1264 320 400 320
WIRE 400 352 400 320
WIRE 400 464 400 432
WIRE 1264 528 400 528
WIRE 400 560 400 528
WIRE 400 672 400 640
FLAG 128 144 d
IOPIN 128 144 In
FLAG 128 192 q
IOPIN 128 192 In
FLAG 1264 128 a
IOPIN 1264 128 Out
FLAG 400 272 0
FLAG 160 240 zero
IOPIN 160 240 In
FLAG 160 320 theta
IOPIN 160 320 In
FLAG 1264 320 b
IOPIN 1264 320 Out
FLAG 400 464 0
FLAG 1264 528 c
IOPIN 1264 528 Out
FLAG 400 672 0
SYMBOL bv 400 144 R0
SYMATTR InstName B1
SYMATTR Value V=(V(d)*cos(V(theta))-V(q)*sin(V(theta))+V(zero))
SYMBOL bv 400 336 R0
SYMATTR InstName B2
SYMATTR Value V=(V(d)*cos(V(theta)-2*PI/3)-V(q)*sin(V(theta)-2*PI/3)+V(zero))
SYMBOL bv 400 544 R0
SYMATTR InstName B3
SYMATTR Value V=(V(d)*cos(V(theta)+2*PI/3)-V(q)*sin(V(theta)+2*PI/3)+V(zero))
TEXT 48 56 Left 4 ;Inverse Clarke-Park Transform
TEXT 824 64 Left 2 ;2025-09-03
TEXT 80 288 Left 2 ;angle(rad)
TEXT 144 736 Left 2 ;<Revision History>\n2024-12-29: Initial version\n2025-09-03: Corrected the issue where D and Q were reversed.

clarke_park.asc, the sub-circuit schematic file:
Version 4.1
SHEET 1 1500 816
WIRE 1392 96 272 96
WIRE 144 128 96 128
WIRE 272 128 272 96
WIRE 144 176 96 176
WIRE 144 224 96 224
WIRE 272 240 272 208
WIRE 176 288 144 288
WIRE 1392 288 272 288
WIRE 272 320 272 288
WIRE 272 432 272 400
WIRE 1392 496 272 496
WIRE 272 528 272 496
WIRE 272 640 272 608
FLAG 96 128 a
IOPIN 96 128 In
FLAG 96 176 b
IOPIN 96 176 In
FLAG 1392 96 d
IOPIN 1392 96 Out
FLAG 272 240 0
FLAG 96 224 c
IOPIN 96 224 In
FLAG 144 288 theta
IOPIN 144 288 In
FLAG 1392 288 q
IOPIN 1392 288 Out
FLAG 272 432 0
FLAG 1392 496 zero
IOPIN 1392 496 Out
FLAG 272 640 0
SYMBOL bv 272 112 R0
SYMATTR InstName B1
SYMATTR Value V=(2/3)*(V(a)*cos(V(theta))+V(b)*cos(V(theta)-2*PI/3)+V(c)*cos(V(theta)+2*PI/3))
SYMBOL bv 272 304 R0
SYMATTR InstName B2
SYMATTR Value V=-(2/3)*(V(a)*sin(V(theta))+V(b)*sin(V(theta)-2*PI/3)+V(c)*sin(V(theta)+2*PI/3))
SYMBOL bv 272 512 R0
SYMATTR InstName B3
SYMATTR Value V=(1/3)*(V(a)+V(b)+V(c))
TEXT 64 16 Left 4 ;Clarke-Park Transform
TEXT 1264 16 Left 2 ;2025-09-03
TEXT 64 256 Left 2 ;angle(rad)
TEXT 112 744 Left 2 ;<Revision History>\n2024-12-29: Initial version\n2025-09-03: Corrected the issue where D and Q were reversed.

sv_pwm.asc, the sub-circuit schematic file:
Version 4.1
SHEET 1 2540 1384
WIRE 720 464 624 464
WIRE 1264 464 1168 464
WIRE 1824 464 1824 432
WIRE 1824 464 1264 464
WIRE 1952 464 1824 464
WIRE 2160 464 2048 464
WIRE 384 496 368 496
WIRE 624 496 624 464
WIRE 1168 496 1168 464
WIRE 384 544 368 544
WIRE 384 592 368 592
WIRE 624 592 624 576
WIRE 1168 592 1168 576
WIRE 1264 640 1168 640
WIRE 1824 640 1824 608
WIRE 1824 640 1264 640
WIRE 1952 640 1824 640
WIRE 2160 640 2048 640
WIRE 720 656 624 656
WIRE 1168 672 1168 640
WIRE 624 688 624 656
WIRE 1168 768 1168 752
WIRE 624 784 624 768
WIRE 1248 848 1152 848
WIRE 1824 848 1824 816
WIRE 1824 848 1248 848
WIRE 1952 848 1824 848
WIRE 2160 848 2048 848
WIRE 720 880 624 880
WIRE 1152 880 1152 848
WIRE 624 912 624 880
WIRE 1152 976 1152 960
WIRE 624 1008 624 992
WIRE 720 1104 624 1104
WIRE 624 1136 624 1104
WIRE 624 1232 624 1216
FLAG 368 496 a
IOPIN 368 496 In
FLAG 368 544 b
IOPIN 368 544 In
FLAG 368 592 c
IOPIN 368 592 In
FLAG 624 592 0
FLAG 720 464 min
FLAG 624 784 0
FLAG 720 656 max
FLAG 624 1008 0
FLAG 720 880 vcm
FLAG 1168 592 0
FLAG 1264 464 a2
FLAG 1168 768 0
FLAG 1264 640 b2
FLAG 1152 976 0
FLAG 1248 848 c2
FLAG 624 1232 0
FLAG 720 1104 z
FLAG 2160 464 sa
IOPIN 2160 464 Out
FLAG 2160 640 sb
IOPIN 2160 640 Out
FLAG 2160 848 sc
IOPIN 2160 848 Out
FLAG 1824 432 a_
IOPIN 1824 432 Out
FLAG 1824 608 b_
IOPIN 1824 608 Out
FLAG 1824 816 c_
IOPIN 1824 816 Out
SYMBOL bv 624 480 R0
SYMATTR InstName B1
SYMATTR Value V=min(min(V(a),V(b)),V(c))
SYMBOL bv 624 672 R0
SYMATTR InstName B2
SYMATTR Value V=max(max(V(a),V(b)),V(c))
SYMBOL bv 624 896 R0
SYMATTR InstName B3
SYMATTR Value V=(V(min)+V(max))/2
SYMBOL bv 1168 480 R0
SYMATTR InstName B4
SYMATTR Value V=(V(a)-V(vcm))*IF(ug==1,1,2/SQRT(3))+V(z)
SYMBOL bv 1168 656 R0
SYMATTR InstName B5
SYMATTR Value V=(V(b)-V(vcm))*IF(ug==1,1,2/SQRT(3))+V(z)
SYMBOL bv 1152 864 R0
SYMATTR InstName B6
SYMATTR Value V=(V(c)-V(vcm))*IF(ug==1,1,2/SQRT(3))+V(z)
SYMBOL bv 624 1120 R0
SYMATTR InstName B7
SYMATTR Value V=(V(a)+V(b)+V(c))/3
SYMBOL PowerSim\\PWM 2000 464 R0
WINDOW 39 10 56 Bottom 2
SYMATTR SpiceLine freq={freq}
SYMATTR InstName X1
SYMBOL PowerSim\\PWM 2000 640 R0
WINDOW 39 10 56 Bottom 2
SYMATTR SpiceLine freq={freq}
SYMATTR InstName X2
SYMBOL PowerSim\\PWM 2000 848 R0
WINDOW 39 10 56 Bottom 2
SYMATTR SpiceLine freq={freq}
SYMATTR InstName X3
TEXT 360 304 Left 4 ;SV_PWM
TEXT 1976 320 Left 2 ;2026-09-21
TEXT 512 368 Left 2 !.param freq=10k\n.param ug=0
TEXT 752 368 Left 2 ;switching frequency
TEXT 752 400 Left 2 ;0: gain = 2/sqrt(3) (default), 1: gain = 1
TEXT 592 1312 Left 2 ;<Revision History>\n2025-01-04: Initial version\n2026-09-21: Added ug parameter to select unity gain (ug=1) or retain the original 2/sqrt(3) scaling (ug=0, default).

pwm.asc, the sub-circuit schematic file:
Version 4.1
SHEET 1 1668 1312
WIRE 32 64 -96 64
WIRE 432 80 416 80
WIRE 480 80 432 80
WIRE 576 80 480 80
WIRE 704 80 640 80
WIRE 480 96 480 80
WIRE 576 112 576 96
WIRE 32 160 -96 160
WIRE 480 208 480 176
WIRE -96 272 -96 160
WIRE -96 384 -96 352
FLAG -96 64 duty
IOPIN -96 64 In
FLAG 704 80 pwm
IOPIN 704 80 Out
FLAG 480 208 0
FLAG 432 80 c
FLAG 576 112 0
FLAG -96 384 0
FLAG -96 160 saw
SYMBOL res 464 80 R0
SYMATTR InstName R2
SYMATTR Value 1k
SYMBOL Digital\\buf1 576 16 R0
SYMATTR InstName A1
SYMBOL voltage -96 256 R0
WINDOW 123 0 0 Left 0
WINDOW 39 0 0 Left 0
SYMATTR InstName V1
SYMATTR Value PULSE(0 1 {phase/(360*freq)} {IF(tri==0,1/freq-1n,1/(2*freq))} {IF(tri==0,0.5n,1/(2*freq))} {IF(tri==0,0.5n,0)} {1/freq})
TEXT 72 32 Left 2 !.machine\n.state LO 0\n.state HI 1\n.rule HI LO V(saw)>V(duty)\n.rule LO HI V(saw)< V(duty)\n.output (c) state\n.endmachine
TEXT -144 -120 Left 2 !.param freq=100k
TEXT 624 120 Left 2 !.ic V(pwm)=0
TEXT -144 -88 Left 2 !.param phase=0
TEXT -144 -168 Left 4 ;Pulse Width Modulator
TEXT 464 -168 Left 2 ;2026-09-21
TEXT 104 -120 Left 2 ;frequency(Hz)
TEXT -144 -56 Left 2 !.param tri=0
TEXT 104 -56 Left 2 ;0: Saw, 1; Triangular
TEXT 104 -88 Left 2 ;phase(deg)
TEXT -96 448 Left 2 ;<Revision History>\n2024-12-29: Initial version\n2026-09-21: Added tri parameter to select a triangular carrier (tri=1) or retain the original sawtooth carrier (tri=0, default).
RECTANGLE Normal 416 240 32 0 2

mul.asc, the sub-circuit schematic file:
Version 4
SHEET 1 880 680
WIRE 96 48 48 48
WIRE 320 48 240 48
WIRE 96 64 96 48
WIRE 240 64 240 48
WIRE 96 160 96 144
WIRE 240 160 240 144
WIRE 96 208 48 208
WIRE 96 224 96 208
WIRE 96 320 96 304
FLAG 48 48 IN1
IOPIN 48 48 In
FLAG 48 208 IN2
IOPIN 48 208 In
FLAG 240 160 0
FLAG 320 48 OUT
IOPIN 320 48 Out
FLAG 96 160 0
FLAG 96 320 0
SYMBOL bv 240 48 R0
SYMATTR InstName B1
SYMATTR Value V=V(IN1)*V(IN2)
SYMBOL res 80 48 R0
SYMATTR InstName R1
SYMATTR Value 1Meg
SYMBOL res 80 208 R0
SYMATTR InstName R2
SYMATTR Value 1Meg
TEXT -16 -56 Left 4 ;Multiplier

sum.asc, the sub-circuit schematic file:
Version 4
SHEET 1 880 680
WIRE 288 96 208 96
WIRE 208 112 208 96
WIRE 96 128 48 128
WIRE 96 176 48 176
WIRE 208 208 208 192
FLAG 48 128 IN1
IOPIN 48 128 In
FLAG 48 176 IN2
IOPIN 48 176 In
FLAG 208 208 0
FLAG 288 96 OUT
IOPIN 288 96 Out
SYMBOL bv 208 96 R0
SYMATTR InstName B1
SYMATTR Value V=V(IN1)+V(IN2)
TEXT -16 32 Left 4 ;SUM
TEXT 200 40 Left 2 ;2024-12-29

The netlist it stands for:
* PMSM_FOC.asc
X§X1 N005 CONST K=0  ; pins K
X§X2 N002 N001 N003 iGD  ; pins in g s
X§X3 N004 N006 0 iGD  ; pins in g s
X§X4 PWMA N004 N002 deadtime params: dt=10n
X§X11 N011 N009 N013 iGD  ; pins in g s
X§X15 N015 N017 0 iGD  ; pins in g s
X§X16 PWMB N015 N011 deadtime params: dt=10n
V1 VM 0 {Vdrv}
X§X32 A IA N003 IMON rsns=10u  ; pins n out p
X§X35 B IB N013 IMON rsns=10u  ; pins n out p
X§X37 N007 rpm gain params: G={1/(2*PI)*60}
X§X42 VM N001 N003 iNMOS params: esl=1f rsnb=1k csnb=10p ron=10m  ; pins D G S
X§X59 N003 N006 0 iNMOS params: esl=1f rsnb=1k csnb=10p ron=10m  ; pins D G S
X§X64 VM N009 N013 iNMOS params: esl=1f rsnb=1k csnb=10p ron=10m  ; pins D G S
X§X65 N013 N017 0 iNMOS params: esl=1f rsnb=1k csnb=10p ron=10m  ; pins D G S
X§X21 IA N019 lpf params: f=10k n=1 q=0.5
X§X30 rpm rpm_ref iq_ref type2_gm params: avol=100k g=10m fz1=2 fp1=10k vh=30 vl=-30
X§X20 id id_ref ud type2_gm params: avol=100k g=0.5 fz1=100 fp1=20k vh={Vclmp} vl={-Vclmp}
X§X5 iq iq_ref uq type2_gm params: avol=100k g=0.5 fz1=100 fp1=20k vh={Vclmp} vl={-Vclmp}
X§X6 IB N020 lpf params: f=10k n=1 q=0.5
X§X7 N005 A B C N008 N007 torque theta pmsm params: p=4 Kt=0.04 Rw=0.1 Lw=1m J=5e-5 B=5e-4 Ncg=24 cg1=0.01 cg3=0.003 cg5=0.001
X§X8 N012 N010 N014 iGD  ; pins in g s
X§X9 N016 N018 0 iGD  ; pins in g s
X§X10 PWMC N016 N012 deadtime params: dt=10n
X§X17 C IC N014 IMON rsns=10u  ; pins n out p
X§X22 VM N010 N014 iNMOS params: esl=1f rsnb=1k csnb=10p ron=10m  ; pins D G S
X§X26 N014 N018 0 iNMOS params: esl=1f rsnb=1k csnb=10p ron=10m  ; pins D G S
X§X12 N022 ud uq theta_e ua ub uc clarke_parkinv
X§X13 N019 N020 N021 theta_e N022 id iq clarke_park
X§X14 da db dc da_ db_ dc_ PWMA PWMB PWMC sv_pwm params: freq=50k ug=0
X§X18 IC N021 lpf params: f=10k n=1 q=0.5
X§X24 ua N024 N023 mul
X§X27 ub N024 N026 mul
X§X28 uc N024 N027 mul
X§X29 N024 CONST K={1/Vdrv}  ; pins K
X§X31 N023 N025 da sum
X§X33 N026 N025 db sum
X§X34 N027 N025 dc sum
X§X23 N025 CONST K=0.5  ; pins K
X§X40 theta theta_e gain params: G=4
X§X25 id_ref CONST K=0  ; pins K
V2 rpm_ref 0 PWL(0 0 10m 0 +1u 100 100m 100 +1u 400 200m 400 +1u 100)

* block symbol definitions
.subckt deadtime in l h
A1 in 0 0 0 0 0 N002 0 BUF
A2 in 0 0 0 0 0 N001 0 BUF TD={dt}
A3 0 N001 0 N002 0 0 h 0 AND
A4 0 N001 0 N002 0 l 0 0 OR
.param dt=10n
* Deadtime Generator
* deadtime(sec)
* hi-side
* lo-side
* in
* h
* l
* dt
* dt
* 2024-12-29
.ends deadtime

.subckt gain in out
B1 out 0 V={G}*V(in)
.param G=1
* GAIN
* 2024-12-29
.ends gain

.subckt lpf in out
R1 a N001 1k
C1 a 0 {Co}
B1 N001 0 V=V(in)
B2 v0 0 V=V(a)
B3 out 0 V=IF({n}==1,V(v0),V(v1))
R2 v1 0 1Gig
C2 v1 0 1
B5 0 v1 I=V(v2)
R3 v2 0 1Gig
C3 v2 0 1
B4 0 v2 I={-(2*pi*f)*(2*pi*f)*V(v1)-(2*pi*f/q)*V(v2)+(2*pi*f)*(2*pi*f)*V(in)}
* 1st/2nd order Low Pass Filter
* 2025-12-26
.param f=100k
.param n=1
.param q=0.5
.param Co=1/({f}*2k*PI)
* cut off frequency
* filter order (1:1st order, other: 2nd order)
* q factor (only for 2nd order)
* 1st Order LPF
* 2nd Order LPF
* <Revision History>
* 2025-03-23: Initial version
* 2025-12-26:
*  -  Replaced LTspice built in 2ndOrderLPF with discrete circuit to improve convergence.
*  -  Removed output MUX and replaced it with BV.
.ends lpf

.subckt type2_gm fb ref ve
B1 0 ve I=(limit(V(ref)-V(fb),{-Ilim},{Ilim}))
R1 ve N001 {Rz1}
C1 N001 0 {Cz1}
R2 ve 0 {avol}
C2 ve 0 {Co1}
D1 -V ve myD
V1 +V 0 {vh}
V2 -V 0 {vl}
D2 ve +V myD
.param g=1
.param fz1=1k
.param fp1=20k
.param vh=5
.param vl=0
.param avol=100k
* Type 2 Compensator, Gm amp base
* target gain at fz1
* zero frequency(Hz)
* pole frequency(Hz)
* max ouput voltage(V)
* min output voltage(V)
* open loop gain
* 2025-08-31
.param Rz1={(g*avol)/(avol-g)}
.param Cz1={1/(2*PI*fz1*Rz1)}
.param Co1={1/(2*PI*fp1*Rz1)}
.ic V(ve)=0
.MODEL myD D(RON=1u ROFF=1G Vfwd=10n)
.param Ilim=1000
* <Revision History>
* 2025-08-31: Initial version
* feedback
* reference
* * TYPE2_gm is a Gm-amp based version of TYPE2.
* * Unlike the op-amp based TYPE2, it offers high input impedance at ref/fb
* * and is better suited for dynamic reference applications (e.g. soft-start,
* * motor speed control). Both models are kept for flexibility.
.ends type2_gm

.subckt pmsm Tload A B C N omega Tele theta
Ra N001 A {Rw}
La N002 N001 {Lw}
Rb N003 B {Rw}
Lb N004 N003 {Lw}
BEMFb N004 N V={-Kt*V(omega)*sin(p*V(theta)-2*PI/3)}
B3 Tcog 0 V={cg1*Kt*sin(Ncg*V(theta))+cg3*Kt*sin(3*Ncg*V(theta))+cg5*Kt*sin(5*Ncg*V(theta))}
L§J N006 0 {J}
BTrq N005 0 V=V(Tele)-V(Tload)+V(Tcog)
C1 theta 0 1
R§B N006 N005 {B}
B4 0 theta I=V(omega)
BEMFa N002 N V={-Kt*V(omega)*sin(p*V(theta))}
BTele Tele 0 V={Kt*(I(La)*sin(p*V(theta))+I(Lb)*sin(p*V(theta)-2*pi/3)+I(Lc)*sin(p*V(theta)-4*pi/3))}
Rc N007 C {Rw}
Lc N008 N007 {Lw}
BEMFc N008 N V={-Kt*V(omega)*sin(p*V(theta)-4*PI/3)}
R1 N 0 1Gig
B1 omega 0 V=I(J)
.param p=4
.param Rw=0.1
.param Lw=1m
.param J=5e-5
.param B=5e-4
.param Kt=0.04
.param Ncg=24
.param cg1=0.01
.param cg3=0.003
.param cg5=0.001
* Three Phase PermanentMagnet Synchronous Motor (PMSM)
* 2026-09-21
.ic V(theta)=0
.ic I(J)=0
* Inertia
* Friction
.ic I(La)=0
.ic I(Lb)=0
.ic I(Lc)=0
* Number of pole pairs
* Widing Resistance (ohm)
* Widing inductance (H)
* Rotor Inertia (kg・m^2)
* Rotor Friction (N・m・s/rad)
* Torque Constant (N・m/A) or  Back-EMF constant (V/(rad/s))
* Cogging per rotation (least common multiple of 2*p and number of stator slots, e.g. 24 if (2p,Nslot)=(8,12)
* 1st harmonic cogging torque ratio  (cogging torque amplitude divided by Kt)
* 3rd harmonic cogging torque ratio  (cogging torque amplitude divided by Kt)
* 5th harmonic cogging torque ratio  (cogging torque amplitude divided by Kt)
* <Revision History>
* 2025-09-06: Initial version
* 2026-09-21: Corrected BEMF polarity to ensure consistency with winding current directions
* Electrical Domain
* Mechanical Domain
* rad
* rad/s
* N・m
* N・m
* N・m
.ends pmsm

.subckt clarke_parkinv zero d q theta a b c
B1 a 0 V=(V(d)*cos(V(theta))-V(q)*sin(V(theta))+V(zero))
B2 b 0 V=(V(d)*cos(V(theta)-2*PI/3)-V(q)*sin(V(theta)-2*PI/3)+V(zero))
B3 c 0 V=(V(d)*cos(V(theta)+2*PI/3)-V(q)*sin(V(theta)+2*PI/3)+V(zero))
* Inverse Clarke-Park Transform
* 2025-09-03
* angle(rad)
* <Revision History>
* 2024-12-29: Initial version
* 2025-09-03: Corrected the issue where D and Q were reversed.
.ends clarke_parkinv

.subckt clarke_park a b c theta zero d q
B1 d 0 V=(2/3)*(V(a)*cos(V(theta))+V(b)*cos(V(theta)-2*PI/3)+V(c)*cos(V(theta)+2*PI/3))
B2 q 0 V=-(2/3)*(V(a)*sin(V(theta))+V(b)*sin(V(theta)-2*PI/3)+V(c)*sin(V(theta)+2*PI/3))
B3 zero 0 V=(1/3)*(V(a)+V(b)+V(c))
* Clarke-Park Transform
* 2025-09-03
* angle(rad)
* <Revision History>
* 2024-12-29: Initial version
* 2025-09-03: Corrected the issue where D and Q were reversed.
.ends clarke_park

.subckt sv_pwm a b c a_ b_ c_ sa sb sc
B1 min 0 V=min(min(V(a),V(b)),V(c))
B2 max 0 V=max(max(V(a),V(b)),V(c))
B3 vcm 0 V=(V(min)+V(max))/2
B4 a_ 0 V=(V(a)-V(vcm))*IF(ug==1,1,2/SQRT(3))+V(z)
B5 b_ 0 V=(V(b)-V(vcm))*IF(ug==1,1,2/SQRT(3))+V(z)
B6 c_ 0 V=(V(c)-V(vcm))*IF(ug==1,1,2/SQRT(3))+V(z)
B7 z 0 V=(V(a)+V(b)+V(c))/3
X§X1 a_ sa pwm params: tri=0 freq={freq} phase=0
X§X2 b_ sb pwm params: tri=0 freq={freq} phase=0
X§X3 c_ sc pwm params: tri=0 freq={freq} phase=0
* SV_PWM
* 2026-09-21
.param freq=10k
.param ug=0
* switching frequency
* 0: gain = 2/sqrt(3) (default), 1: gain = 1
* <Revision History>
* 2025-01-04: Initial version
* 2026-09-21: Added ug parameter to select unity gain (ug=1) or retain the original 2/sqrt(3) scaling (ug=0, default).
.ends sv_pwm

.subckt pwm duty pwm
R2 c 0 1k
A1 c 0 0 0 0 0 pwm 0 BUF
V1 saw 0 PULSE(0 1 {phase/(360*freq)} {IF(tri==0,1/freq-1n,1/(2*freq))} {IF(tri==0,0.5n,1/(2*freq))} {IF(tri==0,0.5n,0)} {1/freq})
.machine
.state LO 0
.state HI 1
.rule HI LO V(saw)>V(duty)
.rule LO HI V(saw)< V(duty)
.output (c) state
.endmachine
.param freq=100k
.ic V(pwm)=0
.param phase=0
* Pulse Width Modulator
* 2026-09-21
* frequency(Hz)
.param tri=0
* 0: Saw, 1; Triangular
* phase(deg)
* <Revision History>
* 2024-12-29: Initial version
* 2026-09-21: Added tri parameter to select a triangular carrier (tri=1) or retain the original sawtooth carrier (tri=0, default).
.ends pwm

.subckt mul in1 in2 out
B1 OUT 0 V=V(IN1)*V(IN2)
R1 IN1 0 1Meg
R2 IN2 0 1Meg
* Multiplier
.ends mul

.subckt sum in1 in2 out
B1 OUT 0 V=V(IN1)+V(IN2)
* SUM
* 2024-12-29
.ends sum

.model D D
.lib standard.dio
.tran 0.3
.options solver="norm"
.options method="gear"
* PMSM, FOC (Field Oriented Control)
* Motor
* 2025.09.06
* Power Stage
* Torque Control
* Flux Control
;.options debugtran
* Velocity Control
.param Vdrv=48
* FOC Control
* gm
* gm
* gm
* Clarke-Park
* Clarke-Park
* Inverse
.param Vclmp=Vdrv/sqrt(3)
.backanno
.end